# Altium schematic sheet St-LinkV2.SchDoc
size A4; PageSetup: Record=PageOptions|CenterHorizontal=True|CenterVertical=True|PrintScale=0.71|XCorrection=1.00|YCorrection=1.00|PrintKind=2|BorderSize=5000000|LeftOffset=0|BottomOffset=0|Orientation=2|PaperLength=1000|PaperWidth=1000|Scale=100|PaperSource=7|PrintQuality=-3|MediaType=1|DitherType=10|PrintScaleMode=1|PaperKind=A4|PaperIndex=9
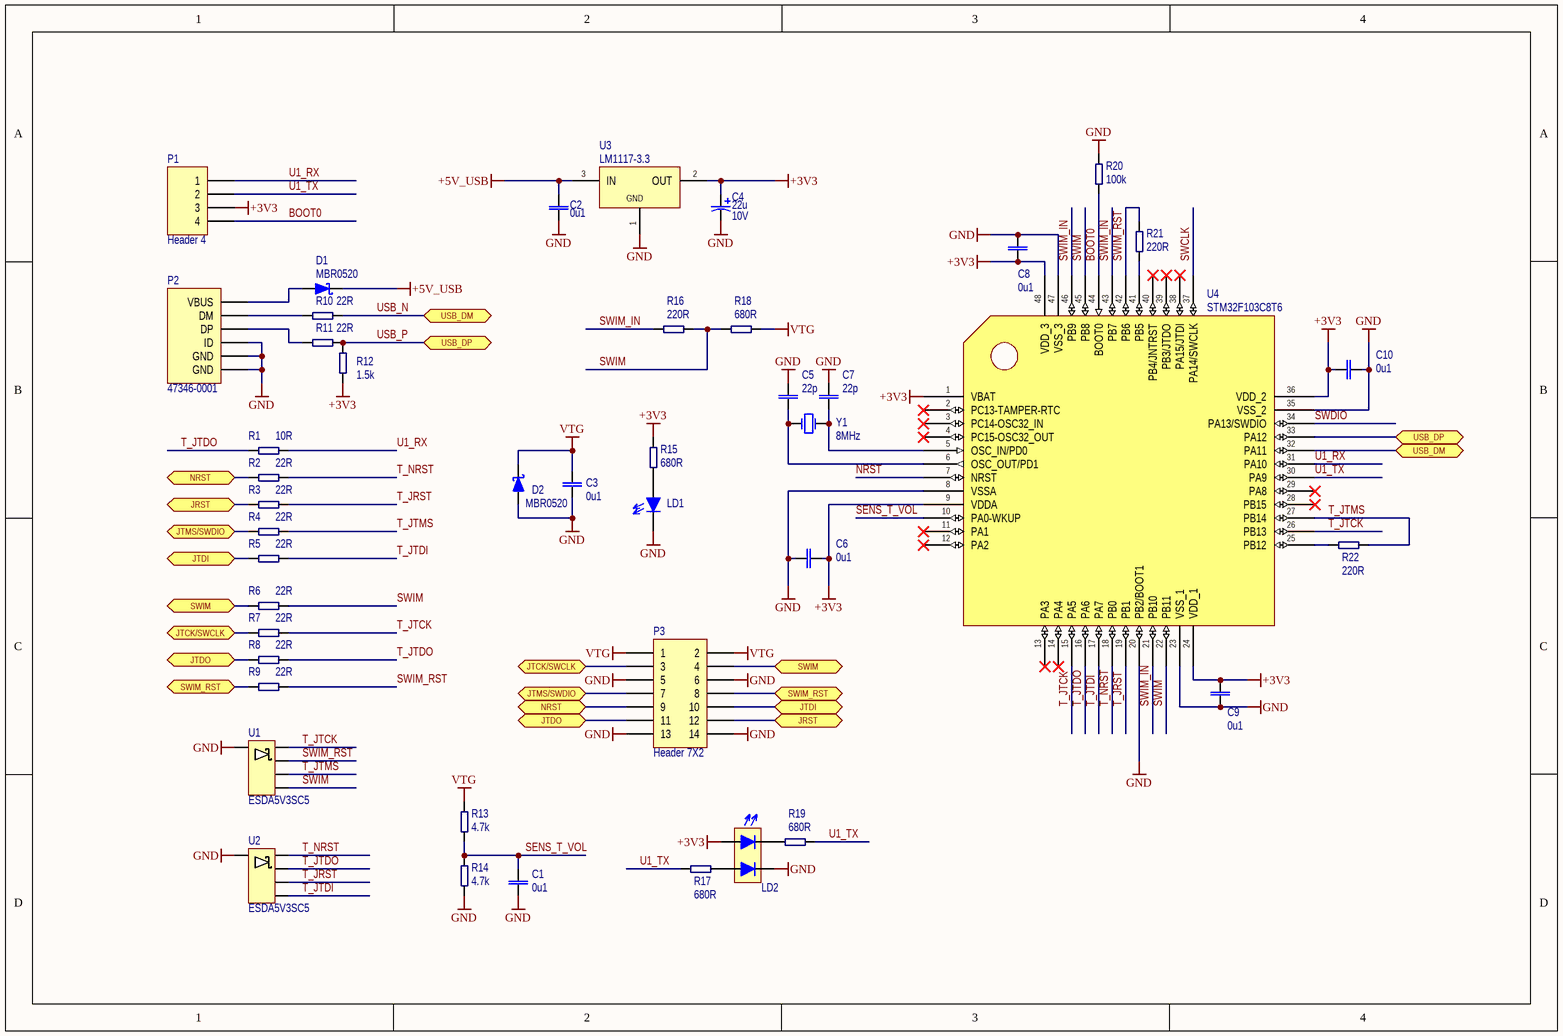
[diagram p0: St-LinkV2.SchDoc]

## Parts
C1  0u1  [C0603C]
C2  0u1  [C0603C]
C3  0u1  [C0603C]
C4  22u  Voltage: 10V  [CAPMP3216X180N]
C5  22p  [C0603C]
C6  0u1  [C0603C]
C7  22p  [C0603C]
C8  0u1  [C0603C]
C9  0u1  [C0603C]
C10  0u1  [C0603C]
D1  MBR0520  [SOD-123]
D2  MBR0520  [SOD-123]
LD1  Led Green  [LED0805]  (value not drawn)
LD2  FYLS-1210 EGW  [FYLS-1210]  (value not drawn)
P1  Header 4  [HDR1X4]
P2  47346-0001  [USB_Micro-B_FCI_SMD]
P3  Header 7X2  [IDC-14MS-EDGE]
R1  10R  [C0603R]
R2  22R  [C0603R]
R3  22R  [C0603R]
R4  22R  [C0603R]
R5  22R  [C0603R]
R6  22R  [C0603R]
R7  22R  [C0603R]
R8  22R  [C0603R]
R9  22R  [C0603R]
R10  22R  [C0603R]
R11  22R  [C0603R]
R12  1.5k  [C0603R]
R13  4.7k  [C0603R]
R14  4.7k  [C0603R]
R15  680R  [C0603R]
R16  220R  [C0603R]
R17  680R  [C0603R]
R18  680R  [C0603R]
R19  680R  [C0603R]
R20  100k  [C0603R]
R21  220R  [C0603R]
R22  220R  [C0603R]
U1  ESDA5V3SC5  [SOT23-5]
U2  ESDA5V3SC5  [SOT23-5]
U3  LM1117-3.3  [SOT223]
U4  STM32F103C8T6  [LQFP48]
Y1  8MHz  [HC-49H]

## Ports
JRST, JTCK/SWCLK, JTDI, JTDO, JTMS/SWDIO, NRST, SWIM, SWIM_RST, USB_DM (bidir), USB_DP (bidir)

## Nets
+3V3: C4.1 C6.2 C8.2 C9.1 C10.1 LD2.1 P1.3 R12.1 R15.2 U3.2(OUT) U4.1(VBAT) U4.9(VDDA) U4.24(VDD_1) U4.36(VDD_2) U4.48(VDD_3)
+5V_USB: C2.2 D1.1(K) U3.3(IN)
GND: C1.1 C2.1 C3.1 C4.2 C5.1 C6.1 C7.1 C8.1 C9.2 C10.2 D2.2(A) LD1.2 LD2.4 P2.4(ID) P2.5(GND) P2.6(GND) P3.5 P3.6 P3.13 P3.14 R14.1 R20.2 U1.2 U2.2 U3.1(GND) U4.8(VSSA) U4.20(PB2/BOOT1) U4.23(VSS_1) U4.35(VSS_2) U4.47(VSS_3)
VTG: C3.2 D2.1(K) P3.1 P3.2 R13.2 R18.2
BOOT0: P1.4 R20.1 U4.44(BOOT0)
JRST: P3.12 R3.2 ; port JRST
JTCK/SWCLK: P3.3 R7.2 ; port JTCK/SWCLK
JTDI: P3.10 R5.2 ; port JTDI
JTDO: P3.11 R8.2 ; port JTDO
JTMS/SWDIO: P3.7 R4.2 ; port JTMS/SWDIO
NRST: U4.7(NRST)
NRST: P3.9 R2.2 ; port NRST  [a separate net that carries the same name]
SENS_T_VOL: C1.2 R13.1 R14.2 U4.10(PA0-WKUP)
SWCLK: U4.37(PA14/SWCLK)
SWDIO: U4.34(PA13/SWDIO)
SWIM: R6.1 R16.2 R18.1 U1.5 U4.22(PB11) U4.45(PB8)
SWIM: P3.4 R6.2 ; port SWIM  [a separate net that carries the same name]
SWIM_IN: R16.1 U4.21(PB10) U4.43(PB7) U4.46(PB9)
SWIM_RST: R9.1 R21.2 U1.3 U4.42(PB6)
SWIM_RST: P3.8 R9.2 ; port SWIM_RST  [a separate net that carries the same name]
T_JRST: R3.1 U2.4 U4.19(PB1)
T_JTCK: R7.1 U1.1 U4.15(PA5) U4.26(PB13)
T_JTDI: R5.1 U2.5 U4.17(PA7)
T_JTDO: R1.2 R8.1 U2.3 U4.16(PA6)
T_JTMS: R4.1 R22.2 U1.4 U4.27(PB14)
T_NRST: R2.1 U2.1 U4.18(PB0)
U1_RX: P1.1 R1.1 U4.31(PA10)
U1_TX: P1.2 R17.1 R19.2 U4.30(PA9)
USB_N: R10.2 U4.32(PA11) ; port USB_DM
USB_P: R11.2 R12.2 U4.33(PA12) ; port USB_DP
NetC5_2: C5.2 U4.6(OSC_OUT/PD1) Y1.1(OSC1)
NetC7_2: C7.2 U4.5(OSC_IN/PD0) Y1.2(OSC2)
NetD1_2: D1.2(A) P2.1(VBUS)
NetLD1_1: LD1.1 R15.1
NetLD2_2: LD2.2 R19.1
NetLD2_3: LD2.3 R17.2
NetP2_2: P2.2(DM) R10.1
NetP2_3: P2.3(DP) R11.1
NetR21_1: R21.1 U4.41(PB5)
NetR22_1: R22.1 U4.25(PB12)

Not connected (* = marked no-connect by the designer): U4 2(PC13-TAMPER-RTC)* 3(PC14-OSC32_IN)* 4(PC15-OSC32_OUT)* 11(PA1)* 12(PA2)* 13(PA3)* 14(PA4)* 28(PB15)* 29(PA8)* 38(PA15/JTDI)* 39(PB3/JTDO)* 40(PB4/JNTRST)*

## Notes on the sheet
- Title
- Size:
- Date:
- A4
- Number:
- Time:
- Revision:
- Sheet
- of
- File:

## Library data of the parts
C1-C3 C6 C8-C10 = Cap0u1: Capacitor 0u1; Part Number: Cap0u1; Human_Readable: Capacitor 0u1, package SMD 0603; Package: SMD 0603; Footprint Patch: pcb.pcblib; Value: 0u1; ComponentLink1URL: *; ComponentLink1Description: Datasheet; Footprint_Description: Chip Capacitorr EIA 0603. METRIC 1608, 2-Leads, Body 1,6x0,8mm, IPC Medium Density; Manufacturer: *; Manufacturer Part Number: *; Category: Caps
C4 = CapPolar22u: Polarized capacitor 22u*10V; Part Number: CapPolar22u; Package: CAPMP3216X180N; Footprint Patch: pcb.pcblib; Value: 22u; ComponentLink1URL: *; ComponentLink1Description: Datasheet; Footprint_Description: Capacitor, polarized, Molded Body, EIA 535BAAC size A; 3.20mm L X 1.60mm W X 1.80mm H; Manufacturer: *; Manufacturer Part Number: *; Category: Caps Polar
C5 C7 = Cap22p: Capacitor 22p; Part Number: Cap22p; Human_Readable: Capacitor 22p, package SMD 0603; Package: SMD 0603; Footprint Patch: pcb.pcblib; Value: 22p; ComponentLink1URL: *; ComponentLink1Description: Datasheet; Footprint_Description: Chip Capacitorr EIA 0603. METRIC 1608, 2-Leads, Body 1,6x0,8mm, IPC Medium Density; Manufacturer: *; Manufacturer Part Number: *; Category: Caps
D1 D2 = MBR0520: Diode MBR0520; Part Number: MBR0520; Package: SOD-123; Footprint Patch: pcb.pcblib; ComponentLink1URL: *; ComponentLink1Description: Datasheet; Manufacturer: *; Manufacturer Part Number: *; Category: Diodes
LD1 = Led Green: Diode Led Green; Part Number: Led Green; Package: 0805; Footprint Patch: pcb.pcblib; ComponentLink1URL: *; ComponentLink1Description: Datasheet; Manufacturer: *; Manufacturer Part Number: *; Category: Diodes
LD2 = FYLS-1210 EGW: *; Human_Readable: Bi-Colour 1210 SMT Top Mount Chip LED; Part Number: FYLS-1210 EGW; Package: 2.0X1.25X1.1; Footprint Patch: pcb.pcblib; ComponentLink1URL: http://cp.literature.agilent.com/litweb/pdf/5988-2709EN.pdf; ComponentLink1Description: Datasheet; Footprint_Description: Generic 1210 Bi-Colour SMT LED; Manufacturer: *; Manufacturer Part Number: FYLS-1210 EGW; Category: Diodes
P1 = Header 4: Connector Header 4; Part Number: Header 4; Footprint Patch: pcb.pcblib; ComponentLink1URL: *; ComponentLink1Description: Datasheet; Footprint_Description: Connector; Header; 4 Position; Manufacturer: *; Manufacturer Part Number: *; Category: Connectors
P2 = 47346-0001: Micro-USB B Receptacle with Flange, Bottom Mount, Surface Mount, Lead-Free; Manufacturer: Molex; Part Number: 47346-0001; Footprint Patch: pcb.pcblib; ComponentLink1URL: http://www.molex.com/pdm_docs/sd/473460001_sd.pdf; ComponentLink1Description: Datasheet; Human_Readable: Micro-USB B Receptacle with Flange, Bottom Mount, Surface Mount, Lead-Free; Footprint_Description: Micro-USB B Receptacle with Flange, Bottom Mount, Surface Mount, Lead-Free; Manufacturer Part Number: 47346-0001; Category: Connectors
P3 = IDC-14MS-EDGE: Connector IDC-14MS-EDGE; Part Number: IDC-14MS-EDGE; Footprint Patch: pcb.pcblib; ComponentLink1URL: *; ComponentLink1Description: Datasheet; Manufacturer: *; Manufacturer Part Number: *; Category: Connectors
R1 = Res-10R-SMD 0603: Resistor 10R SMD 0603; Human_Readable: Resistor 10R, package SMD 0603; Part Number: Res-10R-SMD 0603; Package: SMD 0603; Footprint Patch: pcb.pcblib; Value: 10R; ComponentLink1URL: *; ComponentLink1Description: Datasheet; Footprint_Description: Chip Resistor EIA 0603. METRIC 1608, 2-Leads, Body 1,6x0,8mm, IPC Medium Density; Manufacturer: *; Manufacturer Part Number: *; Category: Resistor
R2-R11 = Res-22R-SMD 0603: Resistor 22R SMD 0603; Human_Readable: Resistor 22R, package SMD 0603; Part Number: Res-22R-SMD 0603; Package: SMD 0603; Footprint Patch: pcb.pcblib; Value: 22R; ComponentLink1URL: *; ComponentLink1Description: Datasheet; Footprint_Description: Chip Resistor EIA 0603. METRIC 1608, 2-Leads, Body 1,6x0,8mm, IPC Medium Density; Manufacturer: *; Manufacturer Part Number: *; Category: Resistor
R12 = Res-1.5k-SMD 0603: Resistor 1.5k SMD 0603; Human_Readable: Resistor 1.5k, package SMD 0603; Part Number: Res-1.5k-SMD 0603; Package: SMD 0603; Footprint Patch: pcb.pcblib; Value: 1.5k; ComponentLink1URL: *; ComponentLink1Description: Datasheet; Footprint_Description: Chip Resistor EIA 0603. METRIC 1608, 2-Leads, Body 1,6x0,8mm, IPC Medium Density; Manufacturer: *; Manufacturer Part Number: *; Category: Resistor
R13 R14 = Res-4.7k-SMD 0603: Resistor 4.7k SMD 0603; Human_Readable: Resistor 4.7k, package SMD 0603; Part Number: Res-4.7k-SMD 0603; Package: SMD 0603; Footprint Patch: pcb.pcblib; Value: 4.7k; ComponentLink1URL: *; ComponentLink1Description: Datasheet; Footprint_Description: Chip Resistor EIA 0603. METRIC 1608, 2-Leads, Body 1,6x0,8mm, IPC Medium Density; Manufacturer: *; Manufacturer Part Number: *; Category: Resistor
R15 R17-R19 = Res-680R-SMD 0603: Resistor 680R SMD 0603; Human_Readable: Resistor 680R, package SMD 0603; Part Number: Res-680R-SMD 0603; Package: SMD 0603; Footprint Patch: pcb.pcblib; Value: 680R; ComponentLink1URL: *; ComponentLink1Description: Datasheet; Footprint_Description: Chip Resistor EIA 0603. METRIC 1608, 2-Leads, Body 1,6x0,8mm, IPC Medium Density; Manufacturer: *; Manufacturer Part Number: *; Category: Resistor
R16 R21 R22 = Res-220R-SMD 0603: Resistor 220R SMD 0603; Human_Readable: Resistor 220R, package SMD 0603; Part Number: Res-220R-SMD 0603; Package: SMD 0603; Footprint Patch: pcb.pcblib; Value: 220R; ComponentLink1URL: *; ComponentLink1Description: Datasheet; Footprint_Description: Chip Resistor EIA 0603. METRIC 1608, 2-Leads, Body 1,6x0,8mm, IPC Medium Density; Manufacturer: *; Manufacturer Part Number: *; Category: Resistor
R20 = Res-100k-SMD 0603: Resistor 100k SMD 0603; Human_Readable: Resistor 100k, package SMD 0603; Part Number: Res-100k-SMD 0603; Package: SMD 0603; Footprint Patch: pcb.pcblib; Value: 100k; ComponentLink1URL: *; ComponentLink1Description: Datasheet; Footprint_Description: Chip Resistor EIA 0603. METRIC 1608, 2-Leads, Body 1,6x0,8mm, IPC Medium Density; Manufacturer: *; Manufacturer Part Number: *; Category: Resistor
U1 U2 = ESDA5V3SC5: Quad Zenner array for ESD protection, 5.3V; Part Number: ESDA5V3SC5; Package: SOT23-5; Footprint Patch: pcb.pcblib; ComponentLink1Description: Datasheet; Human_Readable: Quad Zenner array for ESD protection, 5.3V; Manufacturer Part Number: ESDA5V3SC5; Category: Diodes; ComponentLink1URL: *; Manufacturer: *
U3 = LM1117-3.3: Voltage Regulators LM1117-3.3; Manufacturer: Texas Instruments; Manufacturer Part Number: LM1117MPX-3.3/NOPB; Part Number: LM1117-3.3; Package: SOT223; Footprint Patch: pcb.pcblib; ComponentLink1URL: http://www.ti.com/lit/ds/symlink/lm1117-n.pdf; ComponentLink1Description: Datasheet; Human_Readable: *; Footprint_Description: SOT-223/SC-73; 4 Leads; Body 6.7 x 7.3 mm, inc. leads (LxW max); Category: ICs
U4 = STM32F103C8T6: Microcontroller STM32F103C8T6; Manufacturer: STMicroelectronics; Part Number: STM32F103C8T6; Package: LQFP48; Footprint Patch: pcb.pcblib; ComponentLink1URL: *; ComponentLink1Description: Datasheet; Human_Readable: *; Footprint_Description: *; Manufacturer Part Number: STM32F103C8T6; Category: ICs
Y1 = 8MHz-HC-49H: Crystal 8MHz; Part Number: 8MHz-HC-49H; Package: HC-49H; Footprint Patch: pcb.pcblib; Value: 8MHz; ComponentLink1URL: *; ComponentLink1Description: Datasheet; Manufacturer: *; Manufacturer Part Number: *; Category: Xtals